# Altium schematic sheet Sheet1.SchDoc
size 558 x 431 mm; SheetNumber: 1; SheetTotal: 9; ENG_APP_DATE: --/--/--; DSN_APP_DATE: --/--/--; CHK_APP_DATE: --/--/--
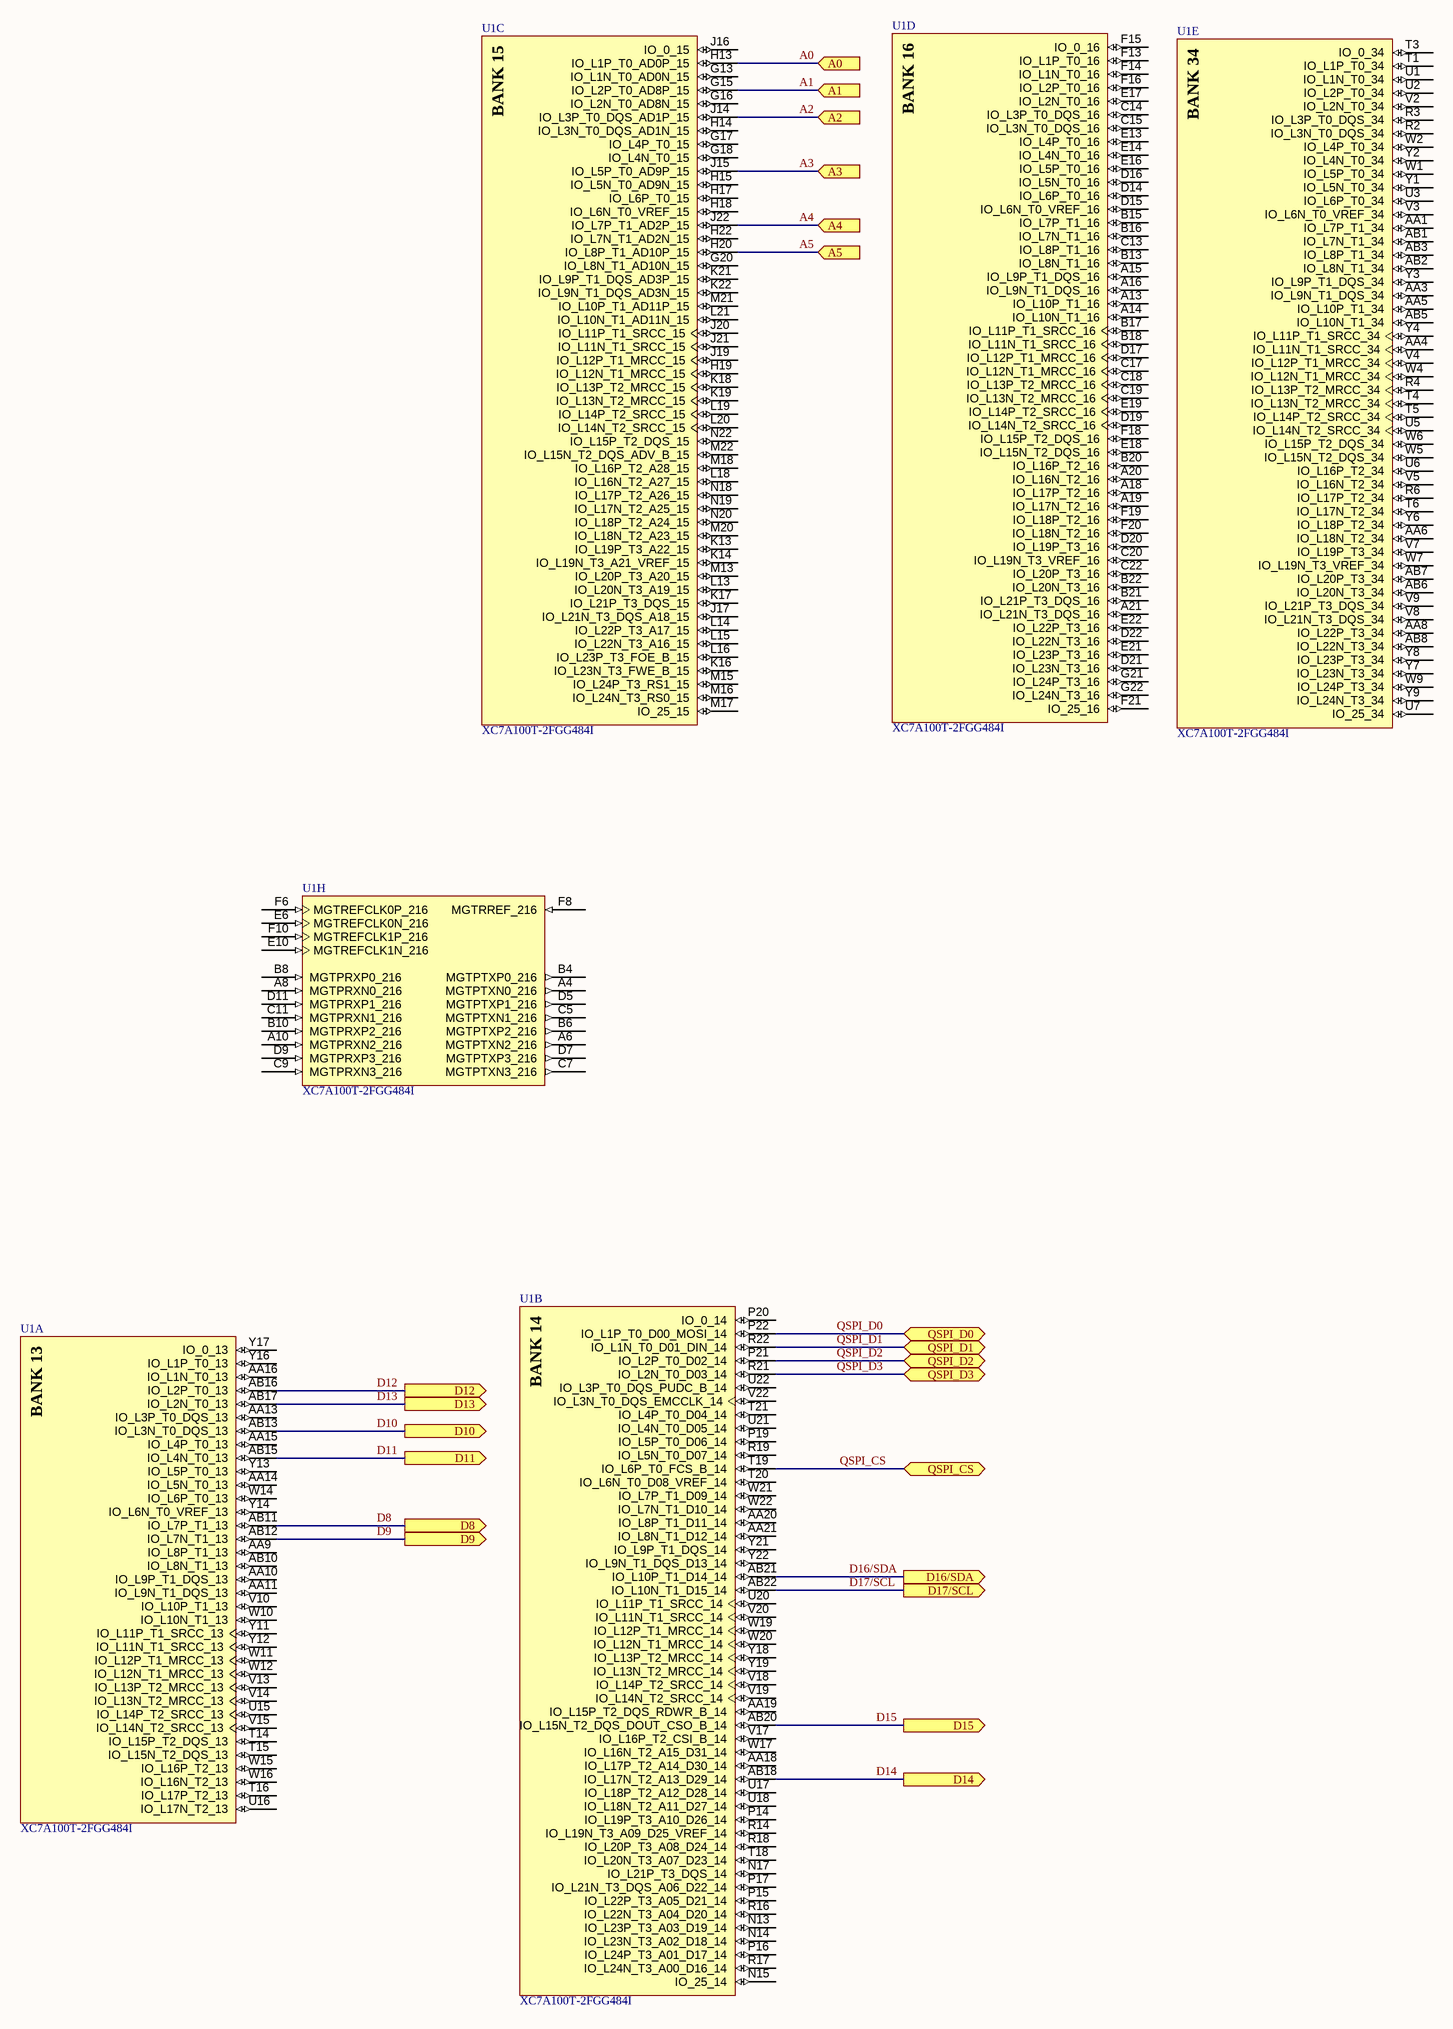
[diagram p0: Sheet1.SchDoc]

## Parts
U1  XC7A100T-2FGG484I  [FGG484]  (parts A,B,C,D,E,H of 10)

## Ports
A0 (in), A1 (in), A2 (in), A3 (in), A4 (in), A5 (in), D8 (out), D9 (out), D10 (out), D11 (out), D12 (out), D13 (out), D14 (out), D15 (out), D16/SDA (out), D17/SCL (out), QSPI_CS (bidir), QSPI_D0 (bidir), QSPI_D1 (bidir), QSPI_D2 (bidir), QSPI_D3 (bidir)

## Nets
A0: U1.H13(IO_L1P_T0_AD0P_15) ; port A0
A1: U1.G15(IO_L2P_T0_AD8P_15) ; port A1
A2: U1.J14(IO_L3P_T0_DQS_AD1P_15) ; port A2
A3: U1.J15(IO_L5P_T0_AD9P_15) ; port A3
A4: U1.J22(IO_L7P_T1_AD2P_15) ; port A4
A5: U1.H20(IO_L8P_T1_AD10P_15) ; port A5
D8: U1.AB11(IO_L7P_T1_13) ; port D8
D9: U1.AB12(IO_L7N_T1_13) ; port D9
D10: U1.AB13(IO_L3N_T0_DQS_13) ; port D10
D11: U1.AB15(IO_L4N_T0_13) ; port D11
D12: U1.AB16(IO_L2P_T0_13) ; port D12
D13: U1.AB17(IO_L2N_T0_13) ; port D13
D14: U1.AB18(IO_L17N_T2_A13_D29_14) ; port D14
D15: U1.AB20(IO_L15N_T2_DQS_DOUT_CSO_B_14) ; port D15
D16/SDA: U1.AB21(IO_L10P_T1_D14_14) ; port D16/SDA
D17/SCL: U1.AB22(IO_L10N_T1_D15_14) ; port D17/SCL
QSPI_CS: U1.T19(IO_L6P_T0_FCS_B_14) ; port QSPI_CS
QSPI_D0: U1.P22(IO_L1P_T0_D00_MOSI_14) ; port QSPI_D0
QSPI_D1: U1.R22(IO_L1N_T0_D01_DIN_14) ; port QSPI_D1
QSPI_D2: U1.P21(IO_L2P_T0_D02_14) ; port QSPI_D2
QSPI_D3: U1.R21(IO_L2N_T0_D03_14) ; port QSPI_D3

Not connected (* = marked no-connect by the designer): U1 A4(MGTPTXN0_216) A6(MGTPTXN2_216) A8(MGTPRXN0_216) A10(MGTPRXN2_216) A13(IO_L10P_T1_16) A14(IO_L10N_T1_16) A15(IO_L9P_T1_DQS_16) A16(IO_L9N_T1_DQS_16) A18(IO_L17P_T2_16) A19(IO_L17N_T2_16) A20(IO_L16N_T2_16) A21(IO_L21N_T3_DQS_16) AA1(IO_L7P_T1_34) AA3(IO_L9N_T1_DQS_34) AA4(IO_L11N_T1_SRCC_34) AA5(IO_L10P_T1_34) AA6(IO_L18N_T2_34) AA8(IO_L22P_T3_34) AA9(IO_L8P_T1_13) AA10(IO_L9P_T1_DQS_13) AA11(IO_L9N_T1_DQS_13) AA13(IO_L3P_T0_DQS_13) AA14(IO_L5N_T0_13) AA15(IO_L4P_T0_13) AA16(IO_L1N_T0_13) AA18(IO_L17P_T2_A14_D30_14) AA19(IO_L15P_T2_DQS_RDWR_B_14) AA20(IO_L8P_T1_D11_14) AA21(IO_L8N_T1_D12_14) AB1(IO_L7N_T1_34) AB2(IO_L8N_T1_34) AB3(IO_L8P_T1_34) AB5(IO_L10N_T1_34) AB6(IO_L20N_T3_34) AB7(IO_L20P_T3_34) AB8(IO_L22N_T3_34) AB10(IO_L8N_T1_13) B4(MGTPTXP0_216) B6(MGTPTXP2_216) B8(MGTPRXP0_216) B10(MGTPRXP2_216) B13(IO_L8N_T1_16) B15(IO_L7P_T1_16) B16(IO_L7N_T1_16) B17(IO_L11P_T1_SRCC_16) B18(IO_L11N_T1_SRCC_16) B20(IO_L16P_T2_16) B21(IO_L21P_T3_DQS_16) B22(IO_L20N_T3_16) C5(MGTPTXN1_216) C7(MGTPTXN3_216) C9(MGTPRXN3_216) C11(MGTPRXN1_216) C13(IO_L8P_T1_16) C14(IO_L3P_T0_DQS_16) C15(IO_L3N_T0_DQS_16) C17(IO_L12N_T1_MRCC_16) C18(IO_L13P_T2_MRCC_16) C19(IO_L13N_T2_MRCC_16) C20(IO_L19N_T3_VREF_16) C22(IO_L20P_T3_16) D5(MGTPTXP1_216) D7(MGTPTXP3_216) D9(MGTPRXP3_216) D11(MGTPRXP1_216) D14(IO_L6P_T0_16) D15(IO_L6N_T0_VREF_16) D16(IO_L5N_T0_16) D17(IO_L12P_T1_MRCC_16) D19(IO_L14N_T2_SRCC_16) D20(IO_L19P_T3_16) D21(IO_L23N_T3_16) D22(IO_L22N_T3_16) E6(MGTREFCLK0N_216) E10(MGTREFCLK1N_216) E13(IO_L4P_T0_16) E14(IO_L4N_T0_16) E16(IO_L5P_T0_16) E17(IO_L2N_T0_16) E18(IO_L15N_T2_DQS_16) E19(IO_L14P_T2_SRCC_16) E21(IO_L23P_T3_16) E22(IO_L22P_T3_16) F6(MGTREFCLK0P_216) F8(MGTRREF_216) F10(MGTREFCLK1P_216) F13(IO_L1P_T0_16) F14(IO_L1N_T0_16) F15(IO_0_16) F16(IO_L2P_T0_16) F18(IO_L15P_T2_DQS_16) F19(IO_L18P_T2_16) F20(IO_L18N_T2_16) F21(IO_25_16) G13(IO_L1N_T0_AD0N_15) G16(IO_L2N_T0_AD8N_15) G17(IO_L4P_T0_15) G18(IO_L4N_T0_15) G20(IO_L8N_T1_AD10N_15) G21(IO_L24P_T3_16) G22(IO_L24N_T3_16) H14(IO_L3N_T0_DQS_AD1N_15) H15(IO_L5N_T0_AD9N_15) H17(IO_L6P_T0_15) H18(IO_L6N_T0_VREF_15) H19(IO_L12N_T1_MRCC_15) H22(IO_L7N_T1_AD2N_15) J16(IO_0_15) J17(IO_L21N_T3_DQS_A18_15) J19(IO_L12P_T1_MRCC_15) J20(IO_L11P_T1_SRCC_15) J21(IO_L11N_T1_SRCC_15) K13(IO_L19P_T3_A22_15) K14(IO_L19N_T3_A21_VREF_15) K16(IO_L23N_T3_FWE_B_15) K17(IO_L21P_T3_DQS_15) K18(IO_L13P_T2_MRCC_15) K19(IO_L13N_T2_MRCC_15) K21(IO_L9P_T1_DQS_AD3P_15) K22(IO_L9N_T1_DQS_AD3N_15) L13(IO_L20N_T3_A19_15) L14(IO_L22P_T3_A17_15) L15(IO_L22N_T3_A16_15) L16(IO_L23P_T3_FOE_B_15) L18(IO_L16N_T2_A27_15) L19(IO_L14P_T2_SRCC_15) L20(IO_L14N_T2_SRCC_15) L21(IO_L10N_T1_AD11N_15) M13(IO_L20P_T3_A20_15) M15(IO_L24P_T3_RS1_15) M16(IO_L24N_T3_RS0_15) M17(IO_25_15) M18(IO_L16P_T2_A28_15) M20(IO_L18N_T2_A23_15) M21(IO_L10P_T1_AD11P_15) M22(IO_L15N_T2_DQS_ADV_B_15) N13(IO_L23P_T3_A03_D19_14) N14(IO_L23N_T3_A02_D18_14) N15(IO_25_14) N17(IO_L21P_T3_DQS_14) N18(IO_L17P_T2_A26_15) N19(IO_L17N_T2_A25_15) N20(IO_L18P_T2_A24_15) N22(IO_L15P_T2_DQS_15) P14(IO_L19P_T3_A10_D26_14) P15(IO_L22P_T3_A05_D21_14) P16(IO_L24P_T3_A01_D17_14) P17(IO_L21N_T3_DQS_A06_D22_14) P19(IO_L5P_T0_D06_14) P20(IO_0_14) R2(IO_L3N_T0_DQS_34) R3(IO_L3P_T0_DQS_34) R4(IO_L13P_T2_MRCC_34) R6(IO_L17P_T2_34) R14(IO_L19N_T3_A09_D25_VREF_14) R16(IO_L22N_T3_A04_D20_14) R17(IO_L24N_T3_A00_D16_14) R18(IO_L20P_T3_A08_D24_14) R19(IO_L5N_T0_D07_14) T1(IO_L1P_T0_34) T3(IO_0_34) T4(IO_L13N_T2_MRCC_34) T5(IO_L14P_T2_SRCC_34) T6(IO_L17N_T2_34) T14(IO_L15P_T2_DQS_13) T15(IO_L15N_T2_DQS_13) T16(IO_L17P_T2_13) T18(IO_L20N_T3_A07_D23_14) T20(IO_L6N_T0_D08_VREF_14) T21(IO_L4P_T0_D04_14) U1(IO_L1N_T0_34) U2(IO_L2P_T0_34) U3(IO_L6P_T0_34) U5(IO_L14N_T2_SRCC_34) U6(IO_L16P_T2_34) U7(IO_25_34) U15(IO_L14P_T2_SRCC_13) U16(IO_L17N_T2_13) U17(IO_L18P_T2_A12_D28_14) U18(IO_L18N_T2_A11_D27_14) U20(IO_L11P_T1_SRCC_14) U21(IO_L4N_T0_D05_14) U22(IO_L3P_T0_DQS_PUDC_B_14) V2(IO_L2N_T0_34) V3(IO_L6N_T0_VREF_34) V4(IO_L12P_T1_MRCC_34) V5(IO_L16N_T2_34) V7(IO_L19P_T3_34) V8(IO_L21N_T3_DQS_34) V9(IO_L21P_T3_DQS_34) V10(IO_L10P_T1_13) V13(IO_L13P_T2_MRCC_13) V14(IO_L13N_T2_MRCC_13) V15(IO_L14N_T2_SRCC_13) V17(IO_L16P_T2_CSI_B_14) V18(IO_L14P_T2_SRCC_14) V19(IO_L14N_T2_SRCC_14) V20(IO_L11N_T1_SRCC_14) V22(IO_L3N_T0_DQS_EMCCLK_14) W1(IO_L5P_T0_34) W2(IO_L4P_T0_34) W4(IO_L12N_T1_MRCC_34) W5(IO_L15N_T2_DQS_34) W6(IO_L15P_T2_DQS_34) W7(IO_L19N_T3_VREF_34) W9(IO_L24P_T3_34) W10(IO_L10N_T1_13) W11(IO_L12P_T1_MRCC_13) W12(IO_L12N_T1_MRCC_13) W14(IO_L6P_T0_13) W15(IO_L16P_T2_13) W16(IO_L16N_T2_13) W17(IO_L16N_T2_A15_D31_14) W19(IO_L12P_T1_MRCC_14) W20(IO_L12N_T1_MRCC_14) W21(IO_L7P_T1_D09_14) W22(IO_L7N_T1_D10_14) Y1(IO_L5N_T0_34) Y2(IO_L4N_T0_34) Y3(IO_L9P_T1_DQS_34) Y4(IO_L11P_T1_SRCC_34) Y6(IO_L18P_T2_34) Y7(IO_L23N_T3_34) Y8(IO_L23P_T3_34) Y9(IO_L24N_T3_34) Y11(IO_L11P_T1_SRCC_13) Y12(IO_L11N_T1_SRCC_13) Y13(IO_L5P_T0_13) Y14(IO_L6N_T0_VREF_13) Y16(IO_L1P_T0_13) Y17(IO_0_13) Y18(IO_L13P_T2_MRCC_14) Y19(IO_L13N_T2_MRCC_14) Y21(IO_L9P_T1_DQS_14) Y22(IO_L9N_T1_DQS_D13_14)

## Notes on the sheet
- DWG. NO.
- REV.
- SHT.
- REVISION
- DESCRIPTION
- DATE
- APPROVED
- THIS DOCUMENT AND THE DATA DISCLOSED HEREIN OR HEREWITH IS THE PROPERTY OF ALTIUM LIMITED AND MAY BE FREELY DISTRIBUTED IN WHOLE. NO RIGHTS ARE RESERVED OR EXPRESS OR IMPLIED WARANTEE GIVEN.
- ENG:
- DSN:
- APPROVALS
- PROJECT
- DOCUMENT REVISION:
- DESIGN ITEM:
- CHK:
- BOM:
- REFERENCE DOCUMENTS
- PROJECT REVISION:
- TITLE
- FAB DWG:
- PCB DWG:
- ASSY DWG:
- SCALE:
- SIZE
- C
- CAGE CODE
- FILE NAME
- DWG NO.
- SHEET
- OF
- REV
- (in symbol CMP-0364-00030-3, part A) BANK 13
- (in symbol CMP-0364-00030-3, part B) BANK 14
- (in symbol CMP-0364-00030-3, part C) BANK 15
- (in symbol CMP-0364-00030-3, part D) BANK 16
- (in symbol CMP-0364-00030-3, part E) BANK 34

## Library data of the parts
U1 = CMP-0364-00030-3: Artix-7 FPGA, 285 User I/Os, 4 GTP, 484-Ball BGA, Speed Grade 2, Industrial Grade, Pb-Free; Manufacturer: Xilinx; DSP48E1 Slices: 240; Speed Grade: -2; Clock Mgmt Tiles (CMTs): 6; Block RAM Blocks (Max Kb): 4860; Max User I/O: 300; Block RAM Blocks (18Kb): 270; CLBs (Slices): 15850; Logic Cells: 101440; Block RAM Blocks (36Kb): 135; ComponentLink2URL: http://www.xilinx.com/support/documentation/user_guides/ug475_7Series_Pkg_Pinout.pdf; DatasheetVersion: v1.12; PartNumber: XC7A100T-2FGG484I; ComponentLink5Description: Packaging and Pinout; PackageDescription: Wire-Bond Fine-Pitch BGA, Body 23 x 23 mm, 1.0 mm Pitch; Mounting Technology: Surface Mount; ComponentLink1Description: Datasheet; ComponentLink4URL: http://www.xilinx.com/support/packagefiles/a7packages/xc7a100tfgg484pkg.txt; PackageVersion: Rev 1.8; NexusDeviceID: XC7A100T-2FGG484I; ComponentLink5URL: http://www.xilinx.com/support/documentation/user_guides/ug475_7Series_Pkg_Pinout.pdf; Code_JEDEC: MS-034-AAJ-1; Generic Part Number: XC7A100T; ComponentLink4Description: Package File; ComponentLink3Description: DC and Switching Characteristics; ComponentLink1URL: http://www.xilinx.com/support/documentation/data_sheets/ds180_7Series_Overview.pdf; CLBs (Max Distributed RAM Kb): 1188; ComponentLink2Description: Package Specification; RoHS: Pb-Free; ComponentLink3URL: http://www.xilinx.com/support/documentation/data_sheets/ds181_Artix_7_Data_Sheet.pdf; PackageReference: FGG484